# Altium schematic sheet Battery Charging.SchDoc
size A; SheetNumber: 5; SheetTotal: 14
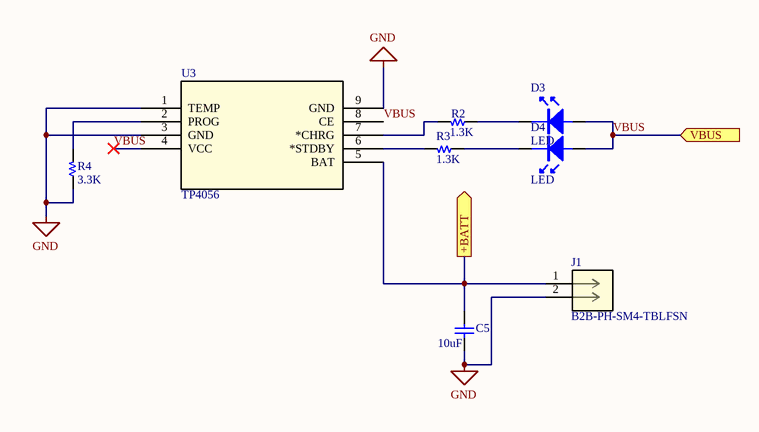
[diagram p0: Battery Charging.SchDoc]

## Parts
C5  10uF  [C 0805]
D3  LED  [CAP10UF]
D4  LED  [CAP10UF]
J1  B2B-PH-SM4-TBLFSN  [CONN_B2B-PH-SM4-TBLFSN_JST]
R2  1.3K  [R 0805]
R3  1.3K  [R 0805]
R4  3.3K  [R 0805]
U3  TP4056  [ESOP8_TPW]

## Ports
+BATT (out, see ESP32[2A], Battery Voltaege Sense[2B], USB Input[2A]), VBUS (in, see ESP32[2A], On-Off Switch[2A], Regulator 3.3V[1B], USB Input[2B])

## Nets
GND: C5.2 J1.2 R4.1 U3.1(TEMP) U3.3(GND) U3.9(GND)
+BATT: C5.1 J1.1 U3.5(BAT) ; port +BATT
VBUS: D3.1 D4.1 U3.4(VCC) U3.8(CE) ; port VBUS
NetD3_2: D3.2 R2.1
NetD4_2: D4.2 R3.1
NetR2_2: R2.2 U3.7(*CHRG)
NetR3_2: R3.2 U3.6(*STDBY)
NetR4_2: R4.2 U3.2(PROG)

## Library data of the parts
C5 = Capacitor NP: Capacitor non-pol
J1 = B2B-PH-SM4-TBLFSN: No Description Available; Mfr_Name: JST; RefDes: RefDes; Type: Type
R2-R4 = Resistor
U3 = TP4056: No Description Available; Mfr_Name: TOPPOWER; RefDes: RefDes; Type: Type